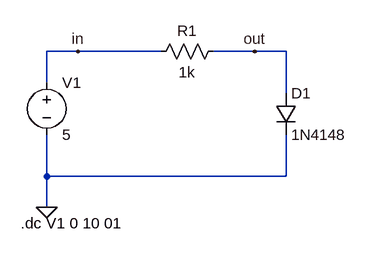
[diagram p0: schematic Diode_I-V_Characteristics_2.2.asc]
Diode_I-V_Characteristics_2.2.asc, the LTspice schematic file:
Version 4.1
SHEET 1 880 680
WIRE 96 96 48 96
WIRE 224 96 96 96
WIRE 368 96 304 96
WIRE 416 96 368 96
WIRE 48 144 48 96
WIRE 416 160 416 96
WIRE 48 288 48 224
WIRE 416 288 416 224
WIRE 416 288 48 288
WIRE 48 336 48 288
FLAG 48 336 0
FLAG 96 96 in
FLAG 368 96 out
SYMBOL voltage 48 128 R0
SYMATTR InstName V1
SYMATTR Value 5
SYMBOL res 320 80 R90
WINDOW 0 0 56 VBottom 2
WINDOW 3 32 56 VTop 2
SYMATTR InstName R1
SYMATTR Value 1k
SYMBOL diode 400 160 R0
SYMATTR InstName D1
SYMATTR Value 1N4148
TEXT 8 360 Left 2 !.dc V1 0 10 01

The netlist it stands for:
* Diode_I-V_Characteristics_2.2.asc
V1 in 0 5
R1 out in 1k
D1 out 0 1N4148
.model D D
.lib standard.dio
.dc V1 0 10 01
.backanno
.end